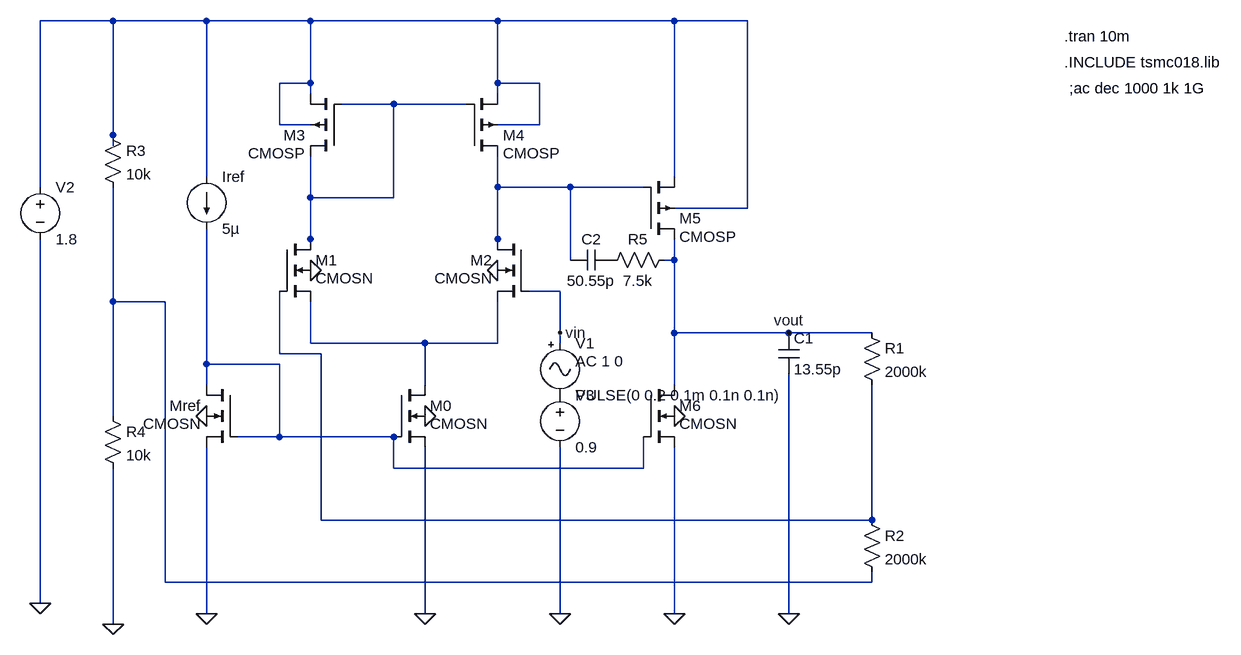
[diagram p0: schematic LTSpice Design file(2 stage OTA).asc]
LTSpice Design file(2 stage OTA).asc, the LTspice schematic file:
Version 4
SHEET 1 880 964
WIRE -2240 -592 -2352 -592
WIRE -2096 -592 -2240 -592
WIRE -1936 -592 -2096 -592
WIRE -1648 -592 -1936 -592
WIRE -1376 -592 -1648 -592
WIRE -1264 -592 -1376 -592
WIRE -1936 -496 -1936 -592
WIRE -1936 -496 -1984 -496
WIRE -1648 -496 -1648 -592
WIRE -1584 -496 -1648 -496
WIRE -1936 -480 -1936 -496
WIRE -1648 -480 -1648 -496
WIRE -1808 -464 -1888 -464
WIRE -1696 -464 -1808 -464
WIRE -1984 -432 -1984 -496
WIRE -1936 -432 -1984 -432
WIRE -1584 -432 -1584 -496
WIRE -1584 -432 -1648 -432
WIRE -2240 -416 -2240 -592
WIRE -2240 -400 -2240 -416
WIRE -2096 -352 -2096 -592
WIRE -1376 -352 -1376 -592
WIRE -2352 -336 -2352 -592
WIRE -1648 -336 -1648 -384
WIRE -1536 -336 -1648 -336
WIRE -1424 -336 -1536 -336
WIRE -1936 -320 -1936 -384
WIRE -1808 -320 -1808 -464
WIRE -1808 -320 -1936 -320
WIRE -1264 -304 -1264 -592
WIRE -1264 -304 -1376 -304
WIRE -1936 -256 -1936 -320
WIRE -1648 -256 -1648 -336
WIRE -1936 -240 -1936 -256
WIRE -1648 -240 -1648 -256
WIRE -1536 -224 -1536 -336
WIRE -1376 -224 -1376 -256
WIRE -1376 -224 -1392 -224
WIRE -1552 -176 -1600 -176
WIRE -2240 -160 -2240 -336
WIRE -2160 -160 -2240 -160
WIRE -1552 -112 -1552 -176
WIRE -1376 -112 -1376 -224
WIRE -1200 -112 -1376 -112
WIRE -1072 -112 -1200 -112
WIRE -1936 -96 -1936 -160
WIRE -1760 -96 -1936 -96
WIRE -1648 -96 -1648 -160
WIRE -1648 -96 -1760 -96
WIRE -1552 -96 -1552 -112
WIRE -1984 -80 -1984 -176
WIRE -1920 -80 -1984 -80
WIRE -2096 -64 -2096 -272
WIRE -1984 -64 -2096 -64
WIRE -2096 -32 -2096 -64
WIRE -1760 -32 -1760 -96
WIRE -1376 -32 -1376 -112
WIRE -2240 16 -2240 -160
WIRE -1984 48 -1984 -64
WIRE -1984 48 -2048 48
WIRE -1808 48 -1984 48
WIRE -1808 96 -1808 48
WIRE -1424 96 -1424 48
WIRE -1424 96 -1808 96
WIRE -1920 176 -1920 -80
WIRE -1072 176 -1072 -32
WIRE -1072 176 -1920 176
WIRE -2160 272 -2160 -160
WIRE -1072 272 -1072 256
WIRE -1072 272 -2160 272
WIRE -2352 304 -2352 -256
WIRE -2096 320 -2096 64
WIRE -1760 320 -1760 64
WIRE -1552 320 -1552 64
WIRE -1376 320 -1376 64
WIRE -1200 320 -1200 -48
WIRE -2240 336 -2240 96
FLAG -1648 -208 0
FLAG -1936 -208 0
FLAG -1760 16 0
FLAG -2096 16 0
FLAG -1376 16 0
FLAG -1376 320 0
FLAG -1552 320 0
FLAG -1760 320 0
FLAG -2096 320 0
FLAG -2352 304 0
FLAG -1200 320 0
FLAG -2240 336 0
FLAG -1552 -112 vin
FLAG -1200 -112 vout
SYMBOL cmosn -2048 -32 M0
WINDOW 3 56 60 Left 2
SYMATTR InstName Mref
SYMATTR Value2 l=1u w=10u
SYMBOL cmosn -1808 -32 R0
WINDOW 3 56 60 Left 2
SYMATTR InstName M0
SYMATTR Value2 l=1u w=100u
SYMBOL cmosn -1424 -32 R0
WINDOW 3 56 60 Left 2
SYMATTR InstName M6
SYMATTR Value2 l=1u w=100u
SYMBOL cmosn -1984 -256 R0
WINDOW 3 56 60 Left 2
SYMATTR InstName M1
SYMATTR Value2 l=1u w=21.74u
SYMBOL cmosn -1600 -256 M0
WINDOW 3 56 60 Left 2
SYMATTR InstName M2
SYMATTR Value2 l=1u w=21.74u
SYMBOL cmosp -1888 -384 R180
WINDOW 3 56 4 Left 2
SYMATTR InstName M3
SYMATTR Value2 l=1u w=2.974u
SYMBOL cmosp -1696 -384 M180
WINDOW 3 56 4 Left 2
SYMATTR InstName M4
SYMATTR Value2 l=1u w=2.974u
SYMBOL current -2096 -352 R0
WINDOW 123 0 0 Left 2
WINDOW 39 0 0 Left 2
SYMATTR InstName Iref
SYMATTR Value 5µ
SYMBOL Misc\\signal -1552 -112 R0
WINDOW 123 24 44 Left 2
WINDOW 39 0 0 Left 2
SYMATTR Value2 AC 1 0
SYMATTR InstName V1
SYMATTR Value PULSE(0 0.2 0.1m 0.1n 0.1n)
SYMBOL cmosp -1424 -256 M180
WINDOW 3 56 4 Left 2
SYMATTR InstName M5
SYMATTR Value2 l=1u w=5.948u
SYMBOL voltage -2352 -352 R0
SYMATTR InstName V2
SYMATTR Value 1.8
SYMBOL res -1088 -128 R0
SYMATTR InstName R1
SYMATTR Value 2000k
SYMBOL cap -1216 -112 R0
SYMATTR InstName C1
SYMATTR Value 13.55p
SYMBOL res -2256 -432 R0
SYMATTR InstName R3
SYMATTR Value 10k
SYMBOL res -2256 0 R0
SYMATTR InstName R4
SYMATTR Value 10k
SYMBOL res -1088 160 R0
SYMATTR InstName R2
SYMATTR Value 2000k
SYMBOL cap -1472 -240 R90
WINDOW 0 0 32 VBottom 2
WINDOW 3 32 32 VTop 2
SYMATTR InstName C2
SYMATTR Value 50.55p
SYMBOL res -1376 -240 R90
WINDOW 0 0 56 VBottom 2
WINDOW 3 32 56 VTop 2
SYMATTR InstName R5
SYMATTR Value 7.5k
SYMBOL voltage -1552 -32 R0
WINDOW 123 0 0 Left 2
WINDOW 39 0 0 Left 2
SYMATTR InstName V3
SYMATTR Value 0.9
TEXT -776 -568 Left 2 !.tran 10m
TEXT -776 -528 Left 2 !.INCLUDE tsmc018.lib
TEXT -768 -488 Left 2 !;ac dec 1000 1k 1G

The netlist it stands for:
* LTSpice Design file(2 stage OTA).asc
Mref N007 N007 0 0 CMOSN l=1u w=10u
M0 N005 N007 0 0 CMOSN l=1u w=100u
M6 vout N007 0 0 CMOSN l=1u w=100u
M1 N002 N006 N005 0 CMOSN l=1u w=21.74u
M2 N003 vin N005 0 CMOSN l=1u w=21.74u
M3 N002 N002 N001 N001 CMOSP l=1u w=2.974u
M4 N003 N002 N001 N001 CMOSP l=1u w=2.974u
Iref N001 N007 5µ
V1 vin P001 PULSE(0 0.2 0.1m 0.1n 0.1n) AC 1 0
M5 vout N003 N001 N001 CMOSP l=1u w=5.948u
V2 N001 0 1.8
R1 vout N006 2000k
C1 vout 0 13.55p
R3 N001 N004 10k
R4 N004 0 10k
R2 N006 N004 2000k
C2 P002 N003 50.55p
R5 vout P002 7.5k
V3 P001 0 0.9
.model NMOS NMOS
.model PMOS PMOS
.lib standard.mos
.tran 10m
.INCLUDE tsmc018.lib
;ac dec 1000 1k 1G
.backanno
.end